# EAGLE schematic 40Ortho (EAGLE 9.6.2)
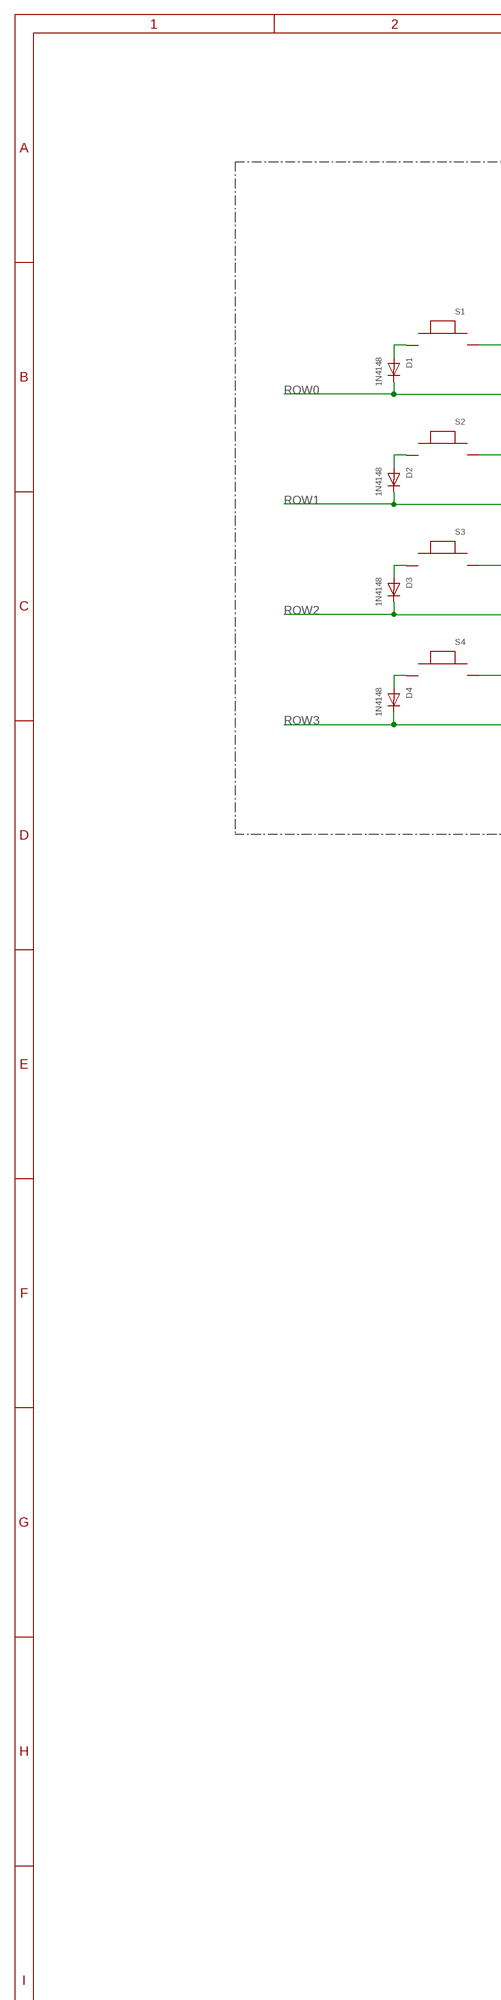
[diagram p0: schematic, sheet 1, part 1 of 2]
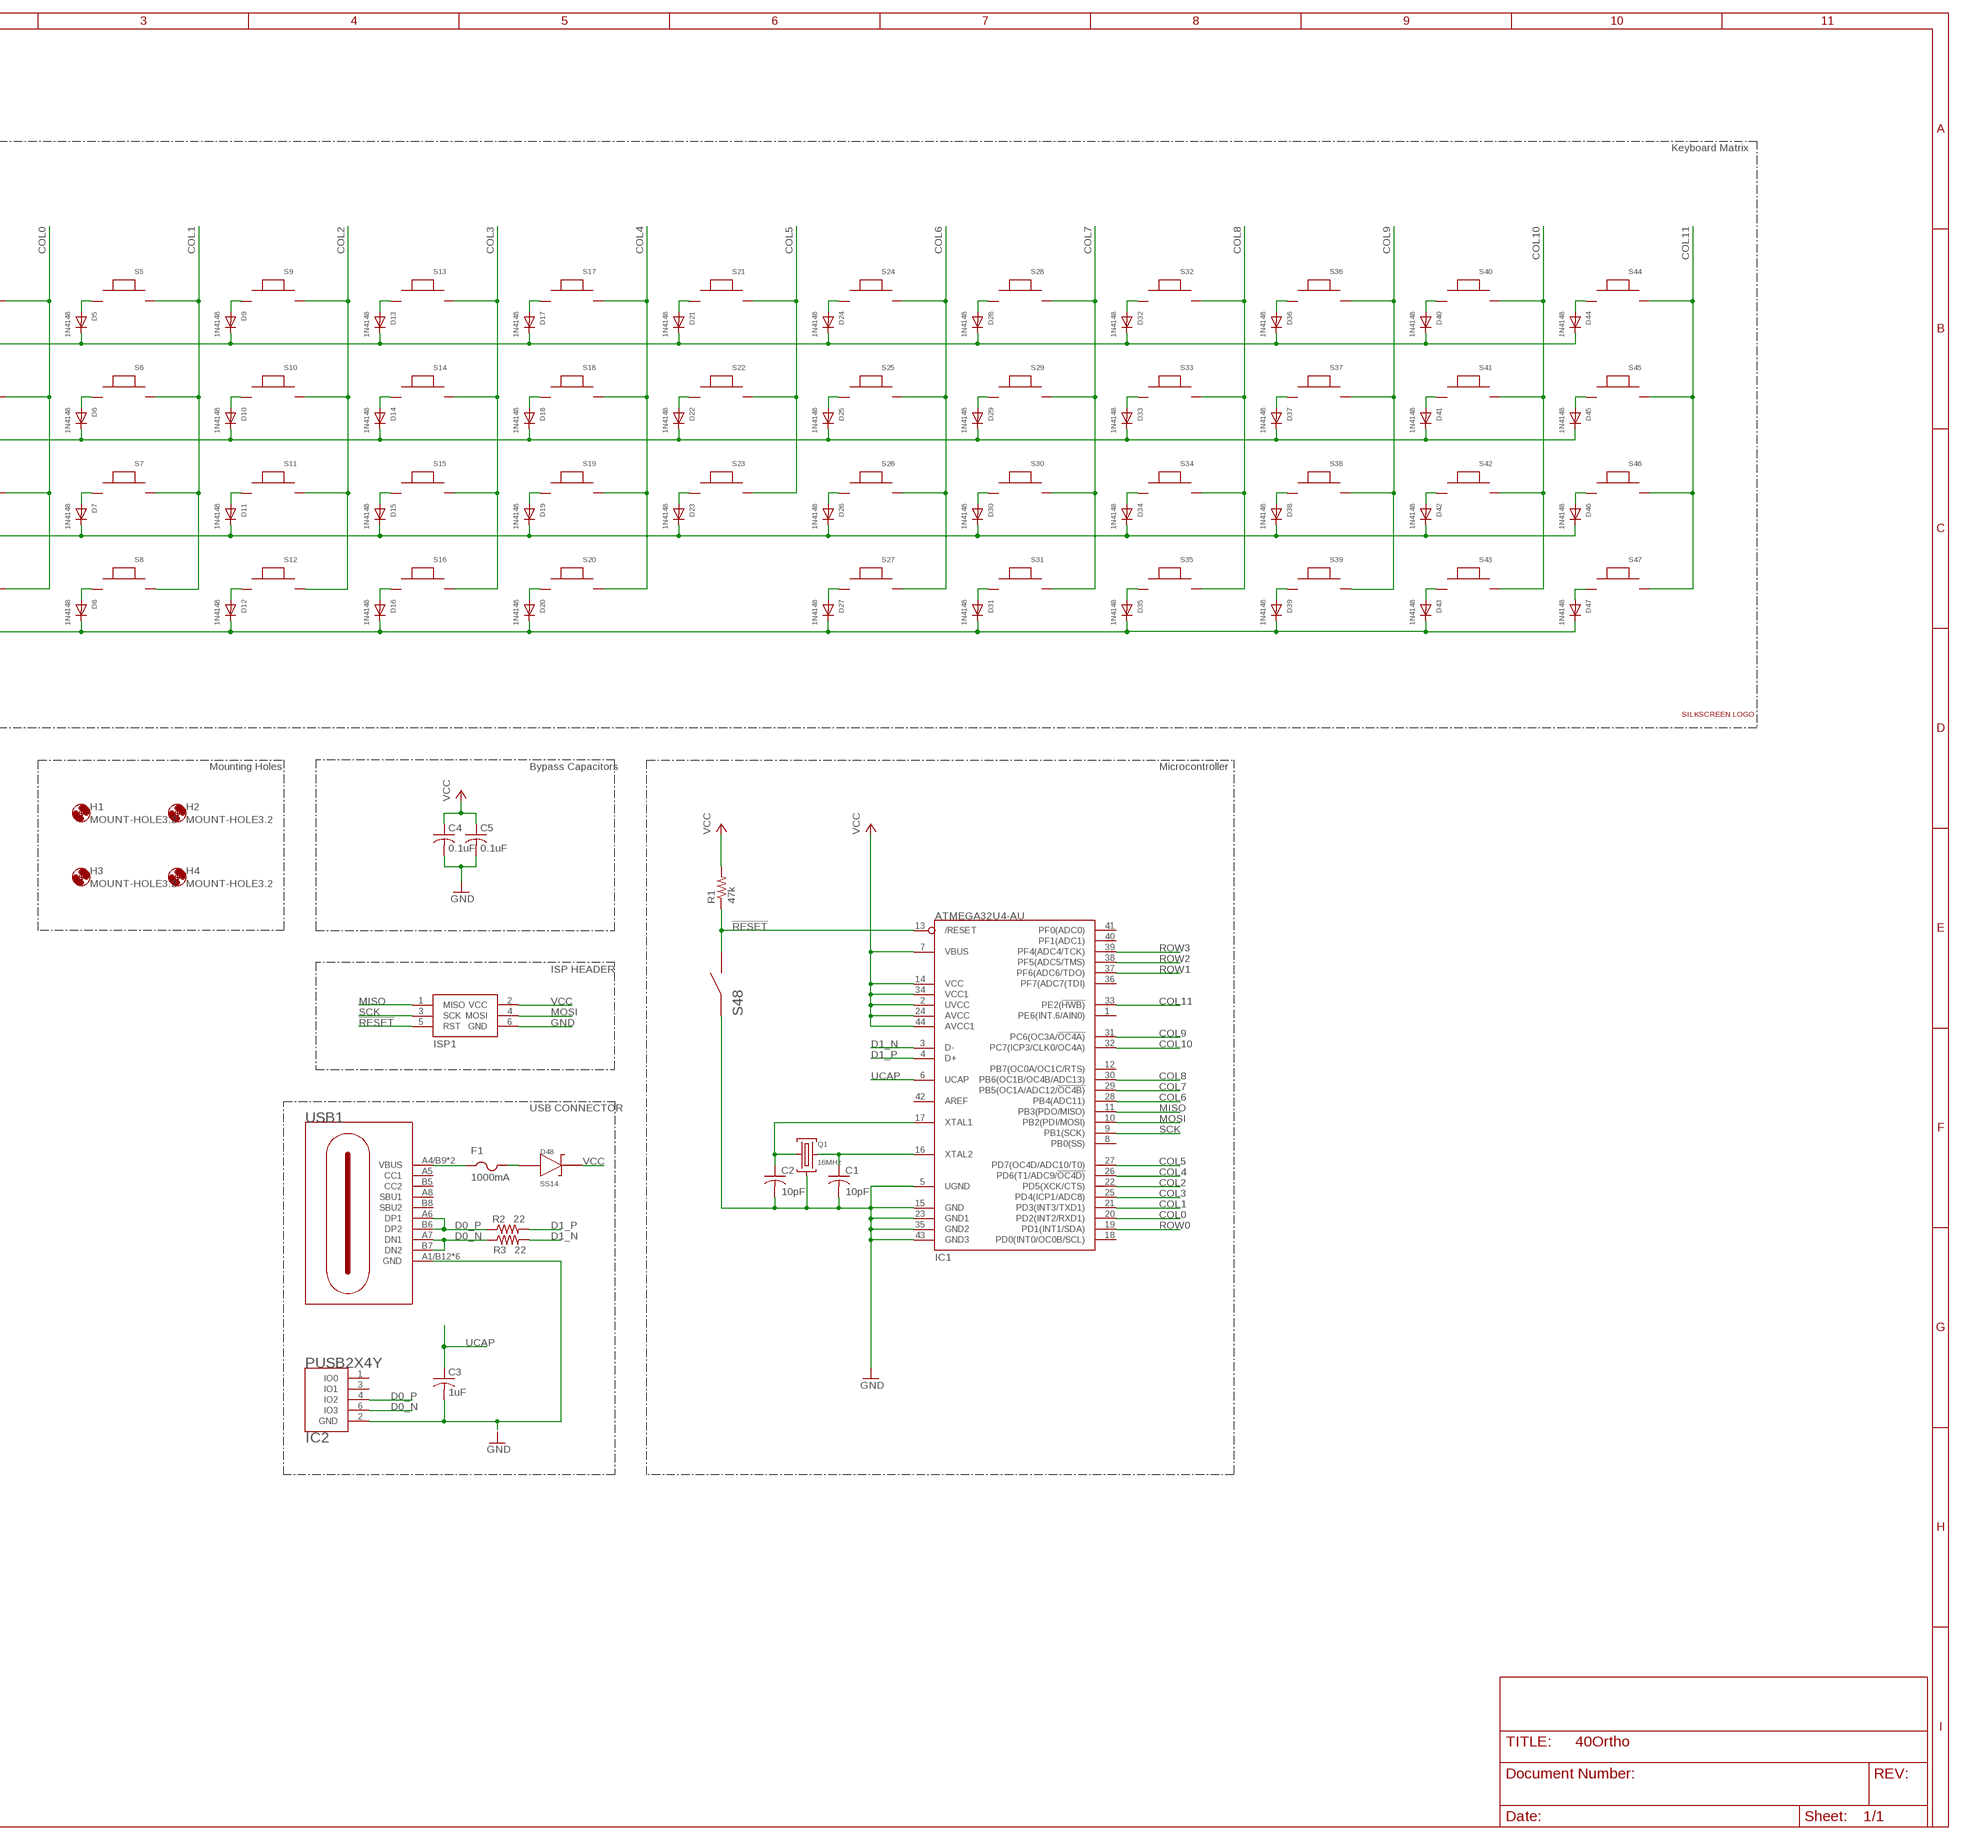
[diagram p1: schematic, sheet 1, part 2 of 2]

## Parts
C1  10pF  C-USC0805  [C0805]
C2  10pF  C-USC0805  [C0805]
C3  1uF  C-USC0805  [C0805]
C4  0.1uF  C-USC0805  [C0805]
C5  0.1uF  C-USC0805  [C0805]
D1  1N4148  DIODESOD-323F  [SOD-323F]
D2  1N4148  DIODESOD-323F  [SOD-323F]
D3  1N4148  DIODESOD-323F  [SOD-323F]
D4  1N4148  DIODESOD-323F  [SOD-323F]
D5  1N4148  DIODESOD-323F  [SOD-323F]
D6  1N4148  DIODESOD-323F  [SOD-323F]
D7  1N4148  DIODESOD-323F  [SOD-323F]
D8  1N4148  DIODESOD-323F  [SOD-323F]
D9  1N4148  DIODESOD-323F  [SOD-323F]
D10  1N4148  DIODESOD-323F  [SOD-323F]
D11  1N4148  DIODESOD-323F  [SOD-323F]
D12  1N4148  DIODESOD-323F  [SOD-323F]
D13  1N4148  DIODESOD-323F  [SOD-323F]
D14  1N4148  DIODESOD-323F  [SOD-323F]
D15  1N4148  DIODESOD-323F  [SOD-323F]
D16  1N4148  DIODESOD-323F  [SOD-323F]
D17  1N4148  DIODESOD-323F  [SOD-323F]
D18  1N4148  DIODESOD-323F  [SOD-323F]
D19  1N4148  DIODESOD-323F  [SOD-323F]
D20  1N4148  DIODESOD-323F  [SOD-323F]
D21  1N4148  DIODESOD-323F  [SOD-323F]
D22  1N4148  DIODESOD-323F  [SOD-323F]
D23  1N4148  DIODESOD-323F  [SOD-323F]
D24  1N4148  DIODESOD-323F  [SOD-323F]
D25  1N4148  DIODESOD-323F  [SOD-323F]
D26  1N4148  DIODESOD-323F  [SOD-323F]
D27  1N4148  DIODESOD-323F  [SOD-323F]
D28  1N4148  DIODESOD-323F  [SOD-323F]
D29  1N4148  DIODESOD-323F  [SOD-323F]
D30  1N4148  DIODESOD-323F  [SOD-323F]
D31  1N4148  DIODESOD-323F  [SOD-323F]
D32  1N4148  DIODESOD-323F  [SOD-323F]
D33  1N4148  DIODESOD-323F  [SOD-323F]
D34  1N4148  DIODESOD-323F  [SOD-323F]
D35  1N4148  DIODESOD-323F  [SOD-323F]
D36  1N4148  DIODESOD-323F  [SOD-323F]
D37  1N4148  DIODESOD-323F  [SOD-323F]
D38  1N4148  DIODESOD-323F  [SOD-323F]
D39  1N4148  DIODESOD-323F  [SOD-323F]
D40  1N4148  DIODESOD-323F  [SOD-323F]
D41  1N4148  DIODESOD-323F  [SOD-323F]
D42  1N4148  DIODESOD-323F  [SOD-323F]
D43  1N4148  DIODESOD-323F  [SOD-323F]
D44  1N4148  DIODESOD-323F  [SOD-323F]
D45  1N4148  DIODESOD-323F  [SOD-323F]
D46  1N4148  DIODESOD-323F  [SOD-323F]
D47  1N4148  DIODESOD-323F  [SOD-323F]
D48  SS14  [DO-214AC]
F1  1000mA  PTCFUSE-1206  [R1206]
H1  MOUNT-HOLE3.2  [3,2]
H2  MOUNT-HOLE3.2  [3,2]
H3  MOUNT-HOLE3.2  [3,2]
H4  MOUNT-HOLE3.2  [3,2]
IC1  ATMEGA32U4-AU  [TQFP44]
IC2  PUSB2X4Y  [SOT363]
ISP1  AVRISP  [AVRISP]
Q1  16MHz  TSX-3225  [TSX-3225]
R1  47k  R-US_R0805  [R0805]
R2  22  R-US_R0805  [R0805]
R3  22  R-US_R0805  [R0805]
S1  MX_SMD_1U  [MX_SMD]
S2  MX_SMD_1U  [MX_SMD]
S3  MX_SMD_1U  [MX_SMD]
S4  MX_SMD_1U  [MX_SMD]
S5  MX_SMD_1U  [MX_SMD]
S6  MX_SMD_1U  [MX_SMD]
S7  MX_SMD_1U  [MX_SMD]
S8  MX_SMD_1U  [MX_SMD]
S9  MX_SMD_1U  [MX_SMD]
S10  MX_SMD_1U  [MX_SMD]
S11  MX_SMD_1U  [MX_SMD]
S12  MX_SMD_1U  [MX_SMD]
S13  MX_SMD_1U  [MX_SMD]
S14  MX_SMD_1U  [MX_SMD]
S15  MX_SMD_1U  [MX_SMD]
S16  MX_SMD_1U  [MX_SMD]
S17  MX_SMD_1U  [MX_SMD]
S18  MX_SMD_1U  [MX_SMD]
S19  MX_SMD_1U  [MX_SMD]
S20  MX_SMD_1U  [MX_SMD]
S21  MX_SMD_1U  [MX_SMD]
S22  MX_SMD_1U  [MX_SMD]
S23  MX_SMD_1U  [MX_SMD]
S24  MX_SMD_1U  [MX_SMD]
S25  MX_SMD_1U  [MX_SMD]
S26  MX_SMD_1U  [MX_SMD]
S27  MX_SMD_2UH  [MX_SMD2U]
S28  MX_SMD_1U  [MX_SMD]
S29  MX_SMD_1U  [MX_SMD]
S30  MX_SMD_1U  [MX_SMD]
S31  MX_SMD_1U  [MX_SMD]
S32  MX_SMD_1U  [MX_SMD]
S33  MX_SMD_1U  [MX_SMD]
S34  MX_SMD_1U  [MX_SMD]
S35  MX_SMD_1U  [MX_SMD]
S36  MX_SMD_1U  [MX_SMD]
S37  MX_SMD_1U  [MX_SMD]
S38  MX_SMD_1U  [MX_SMD]
S39  MX_SMD_1U  [MX_SMD]
S40  MX_SMD_1U  [MX_SMD]
S41  MX_SMD_1U  [MX_SMD]
S42  MX_SMD_1U  [MX_SMD]
S43  MX_SMD_1U  [MX_SMD]
S44  MX_SMD_1U  [MX_SMD]
S45  MX_SMD_1U  [MX_SMD]
S46  MX_SMD_1U  [MX_SMD]
S47  MX_SMD_1U  [MX_SMD]
S48  B3U-1000P  [B3U-1000P]
U$1  LOGO  [LOGO]
USB1  USBC_16PINSMD  [USBC_16PINSMD]

## Nets
!RESET: IC1.13(/RESET) ISP1.5(RST) R1.1 S48.2
COL0: IC1.20(PD2(INT2/RXD1)) S1.P$2 S2.P$2 S3.P$2 S4.P$2
COL1: IC1.21(PD3(INT3/TXD1)) S5.P$2 S6.P$2 S7.P$2 S8.P$2
COL2: IC1.22(PD5(XCK/CTS)) S9.P$2 S10.P$2 S11.P$2 S12.P$2
COL3: IC1.25(PD4(ICP1/ADC8)) S13.P$2 S14.P$2 S15.P$2 S16.P$2
COL4: IC1.26(PD6(T1/ADC9/!OC4D)) S17.P$2 S18.P$2 S19.P$2 S20.P$2
COL5: IC1.27(PD7(OC4D/ADC10/T0)) S21.P$2 S22.P$2 S23.P$2
COL6: IC1.28(PB4(ADC11)) S24.P$2 S25.P$2 S26.P$2 S27.P$2
COL7: IC1.29(PB5(OC1A/ADC12/!OC4B)) S28.P$2 S29.P$2 S30.P$2 S31.P$2
COL8: IC1.30(PB6(OC1B/OC4B/ADC13)) S32.P$2 S33.P$2 S34.P$2 S35.P$2
COL9: IC1.31(PC6(OC3A/!OC4A)) S36.P$2 S37.P$2 S38.P$2 S39.P$2
COL10: IC1.32(PC7(ICP3/CLK0/OC4A)) S40.P$2 S41.P$2 S42.P$2 S43.P$2
COL11: IC1.33(PE2(!HWB)) S44.P$2 S45.P$2 S46.P$2 S47.P$2
D0_N [differential]: IC2.6(IO3) R3.1 USB1.A7(DN1) USB1.B7(DN2)
D0_P [differential]: IC2.4(IO2) R2.1 USB1.A6(DP1) USB1.B6(DP2)
D1_N [differential]: IC1.3(D-) R3.2
D1_P [differential]: IC1.4(D+) R2.2
GND: C1.2 C2.2 C3.2 C4.2 C5.2 IC1.5(UGND) IC1.15(GND) IC1.23(GND1) IC1.35(GND2) IC1.43(GND3) IC2.2(GND) ISP1.6(GND) Q1.2(CVR) Q1.4(CVR) S48.1 USB1.A1/B12(GND) USB1.B1/A12(GND) USB1.GND@1(GND) USB1.GND@2(GND) USB1.GND@3(GND) USB1.GND@4(GND)
MISO: IC1.11(PB3(PDO/MISO)) ISP1.1(MISO)
MOSI: IC1.10(PB2(PDI/MOSI)) ISP1.4(MOSI)
N$1: D32.A S32.P$1
N$2: D33.A S33.P$1
N$3: D34.A S34.P$1
N$4: D35.A S35.P$1
N$5: D36.A S36.P$1
N$6: D37.A S37.P$1
N$7: D38.A S38.P$1
N$8: D8.A S8.P$1
N$9: D40.A S40.P$1
N$10: D1.A S1.P$1
N$11: D2.A S2.P$1
N$12: D3.A S3.P$1
N$13: D4.A S4.P$1
N$14: D41.A S41.P$1
N$15: D5.A S5.P$1
N$16: D6.A S6.P$1
N$17: D9.A S9.P$1
N$18: D10.A S10.P$1
N$19: D7.A S7.P$1
N$20: D12.A S12.P$1
N$21: D42.A S42.P$1
N$22: D11.A S11.P$1
N$23: F1.1 USB1.A4/B9(VBUS) USB1.B4/A9(VBUS)
N$24: D39.A S39.P$1
N$25: D13.A S13.P$1
N$26: D14.A S14.P$1
N$27: D15.A S15.P$1
N$28: D16.A S16.P$1
N$29: D44.A S44.P$1
N$30: D17.A S17.P$1
N$31: D18.A S18.P$1
N$32: D19.A S19.P$1
N$33: D20.A S20.P$1
N$34: D45.A S45.P$1
N$35: D21.A S21.P$1
N$36: D22.A S22.P$1
N$37: D23.A S23.P$1
N$38: D48.1(ANODE) F1.2
N$39: D46.A S46.P$1
N$40: D24.A S24.P$1
N$41: D25.A S25.P$1
N$42: D26.A S26.P$1
N$43: D27.A S27.P$1
N$45: D28.A S28.P$1
N$46: D29.A S29.P$1
N$47: D30.A S30.P$1
N$48: D31.A S31.P$1
N$54: D43.A S43.P$1
N$56: D47.A S47.P$1
ROW0: D1.C D5.C D9.C D13.C D17.C D21.C D24.C D28.C D32.C D36.C D40.C D44.C IC1.19(PD1(INT1/SDA))
ROW1: D2.C D6.C D10.C D14.C D18.C D22.C D25.C D29.C D33.C D37.C D41.C D45.C IC1.37(PF6(ADC6/TDO))
ROW2: D3.C D7.C D11.C D15.C D19.C D23.C D26.C D30.C D34.C D38.C D42.C D46.C IC1.38(PF5(ADC5/TMS))
ROW3: D4.C D8.C D12.C D16.C D20.C D27.C D31.C D35.C D39.C D43.C D47.C IC1.39(PF4(ADC4/TCK))
SCK: IC1.9(PB1(SCK)) ISP1.3(SCK)
UCAP: C3.1 IC1.6(UCAP)
VCC: C4.1 C5.1 D48.2(CATHODE) IC1.2(UVCC) IC1.7(VBUS) IC1.14(VCC) IC1.24(AVCC) IC1.34(VCC1) IC1.44(AVCC1) ISP1.2(VCC) R1.2
XTAL1: C2.1 IC1.17(XTAL1) Q1.3(X2)
XTAL2: C1.1 IC1.16(XTAL2) Q1.1(X1)
Unconnected: IC1.1(PE6(INT.6/AIN0)) IC1.8(PB0(SS)) IC1.12(PB7(OC0A/OC1C/RTS)) IC1.18(PD0(INT0/OC0B/SCL)) IC1.36(PF7(ADC7(TDI)) IC1.40(PF1(ADC1)) IC1.41(PF0(ADC0)) IC1.42(AREF) IC2.1(IO0) IC2.3(IO1) USB1.A5(CC1) USB1.A8(SBU1) USB1.B5(CC2) USB1.B8(SBU2)

## Notes on the sheet
- Keyboard Matrix
- Mounting Holes | Bypass Capacitors | Microcontroller
- ISP HEADER
- USB CONNECTOR

## Library data of the parts
C1-C5 = rcl:C-US: CAPACITOR, American symbol; SPICEPREFIX: C
D1 D6 = adafruit:DIODE: Diode SMADIODE - SMA Surface Mount Package 20V 1A Schottky Diode Digikey: 641-1014-6-ND DO-1N4148 - Through Hole Small Current Diode SOD-123 20V 1 A (.5mV Vf) Schottky Diode - Digikey: MBRX120TPMSCT-ND SOD-323 10V 570mA (.38mV Vf, 3ns) Schottky Diode - Digikey: ZLLS410CT-ND SOD-523 30V 30mA Schottky Diode (RB751S-40TE61) - Digikey: RB751S-40TE61CT-ND SOT23-R/W - SOT23 Package (R = Solder Paste/Reflow Ovens, W = Hand-Soldering) BAT54Film 40V 300mA - Digikey: 497-7162-1-ND; SPICEPREFIX: D
D2-D5 D7-D47 = adafruit:DIODE: Diode SMADIODE - SMA Surface Mount Package 20V 1A Schottky Diode Digikey: 641-1014-6-ND DO-1N4148 - Through Hole Small Current Diode SOD-123 20V 1 A (.5mV Vf) Schottky Diode - Digikey: MBRX120TPMSCT-ND SOD-323 10V 570mA (.38mV Vf, 3ns) Schottky Diode - Digikey: ZLLS410CT-ND SOD-523 30V 30mA Schottky Diode (RB751S-40TE61) - Digikey: RB751S-40TE61CT-ND SOT23-R/W - SOT23 Package (R = Solder Paste/Reflow Ovens, W = Hand-Soldering) BAT54Film 40V 300mA - Digikey: 497-7162-1-ND
D48 = diode - ON Semiconductor:SS14
F1 = adafruit:PTCFUSE: PTC fuses, resettable thermistors
H1-H4 = holes:MOUNT-HOLE: MOUNTING HOLE with drill center marker
IC1 = adafruit:ATMEGA32U4: http://www.ladyada.net/library/eagle
IC2 = ESD Protection:PUSB2X4Y
ISP1 = AVR Headers:AVRISP
Q1 = Crystal_SMD:TSX-3225
R1-R3 = rcl:R-US_: RESISTOR, American symbol; SPICEPREFIX: R
S1-S26 S28-S47 = MX_Switch:MX_SMD_1U: Cherry MX Switch (1 Unit) Package: Cherry MX Description: Outline for 1x Cherry MX style switch. Includes holes for PCB mounted switches. No Diode or LED. Author: Luke LaCasse Date Created/(Modified): 6/30/20 (6/30/20)
S27 = MX_Switch:MX_SMD_2UH: Cherry MX Switch Horizontal (2 Unit) Package: Cherry MX Description: Symbol and Footprint for 1x Cherry MX style switch with spacing for a 2U Horizontal keycap. Includes holes for PCB mounted switches. No Diode or LED. Author: Luke LaCasse Date Created/(Modified): 6/30/20 (6/30/20)
S48 = omron-switch:B3U-1000P
U$1 = Logo 2020:LOGO
USB1 = USB-C:USBC_16PINSMD

## Net classes
1 differential: width 0.152 mm